# EAGLE design WaterThePlants (EAGLE 7.2.0)
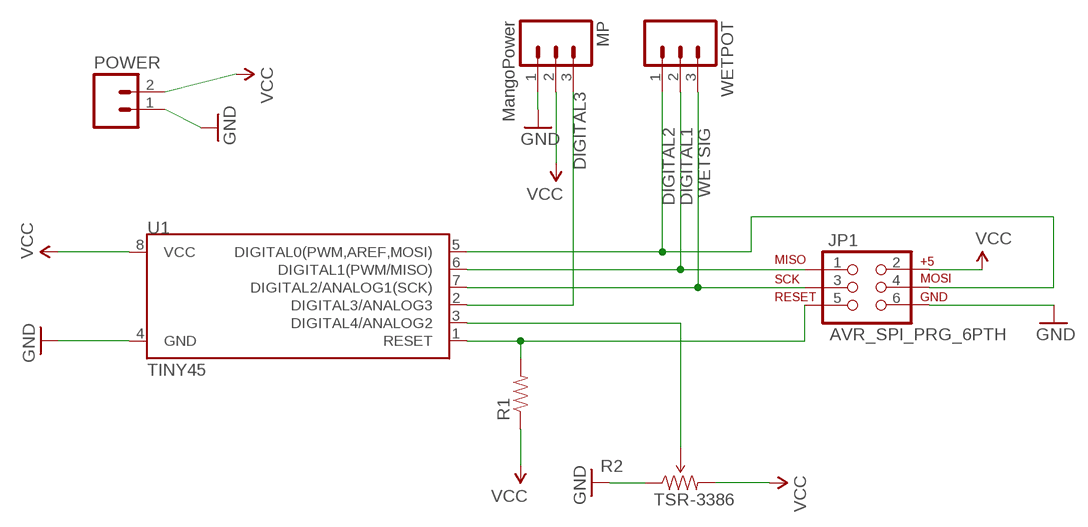
[diagram p0: schematic, sheet 1]

## Parts
JP1  AVR_SPI_PRG_6PTH  [2X3]
MP  MangoPower  M03PTH  [1X03]
POWER  M02POLAR  [MOLEX-1X2]
R1  RESISTORAXIAL-0.3  [AXIAL-0.3]
R2  TSR-3386  TRIMPOT3362U-2  [3362U-2]
U1  TINY45  ARDUINO-ATTINY45/85TINY45-20-DIP  [DIP08]
WETPOT  M03PTH  [1X03]

## Nets
DIGITAL1: JP1.1 U1.6(DIGITAL1(PWM/MISO)) WETPOT.2
DIGITAL2: JP1.4 U1.5(DIGITAL0(PWM,AREF,MOSI)) WETPOT.1
DIGITAL3: MP.3 U1.2(DIGITAL3/ANALOG3)
GND: JP1.6 MP.1 POWER.1 R2.1(CCW) U1.4(GND)
N$1: R2.2(WIPER) U1.3(DIGITAL4/ANALOG2)
N$6: JP1.5 R1.P$2 U1.1(RESET)
VCC: JP1.2 MP.2 POWER.2 R1.P$1 R2.3(CW) U1.8(VCC)
WETSIG: JP1.3 U1.7(DIGITAL2/ANALOG1(SCK)) WETPOT.3

## Library data of the parts
JP1 = SparkFun-Connectors:AVR_SPI_PRG_6: AVR ISP 6 Pin This is the reduced ISP connector for AVR programming. Common on Arduino. This footprint will take up less PCB space and can be used with a 10-pin to 6-pin adapter such as SKU: BOB-08508 **Special note about "TEST_POINT" package. The stop mask is on the top side, so if you want your programming test points to be on the bottom of your board, make sure to place this package on the bottom side of the board. This also ensure that the orientation to program from the bottom side will be correct.
MP WETPOT = SparkFun-Connectors:M03: Header 3 Standard 3-pin 0.1" header. Use with straight break away headers (SKU : PRT-00116), right angle break away headers (PRT-00553), swiss pins (PRT-00743), machine pins (PRT-00117), and female headers (PRT-00115). Molex polarized connector foot print use with SKU : PRT-08232 with associated crimp pins and housings.
POWER = SparkFun-Connectors:M02: Standard 2-pin 0.1" header. Use with - straight break away headers ( PRT-00116) - right angle break away headers (PRT-00553) - swiss pins (PRT-00743) - machine pins (PRT-00117) - female headers (PRT-00115) Molex polarized connector foot print use with: PRT-08233 with associated crimp pins and housings. 2.54_SCREWTERM for use with PRT-10571. 3.5mm Screw Terminal footprints for PRT-08084 5mm Screw Terminal footprints for use with PRT-08432
R1 = SparkFun-Resistors:RESISTOR: Resistor Basic schematic elements and footprints for 0603, 1206, and PTH resistors.
R2 = SparkFun-Electromechanical:TRIMPOT: Various small potentiometers for "set-and-forget" applications
U1 = Parnell-CustomParts:ARDUINO-ATTINY45/85: ARDUINO ATTINY45/85 Atmel 8-pin 2/4/8kB flash uC; PROD_ID: IC-09439; VALUE: TINY45-20-DIP

## Board
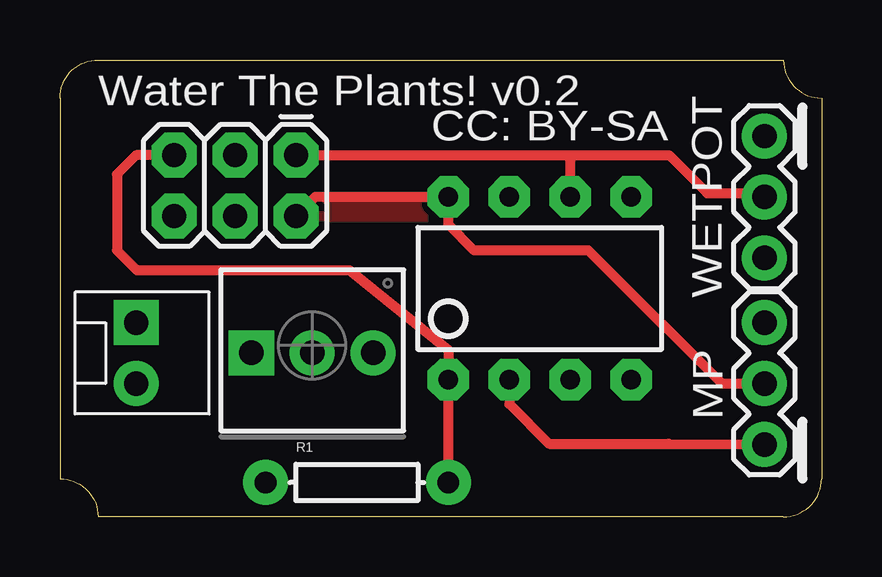
[diagram p1: board, top side]
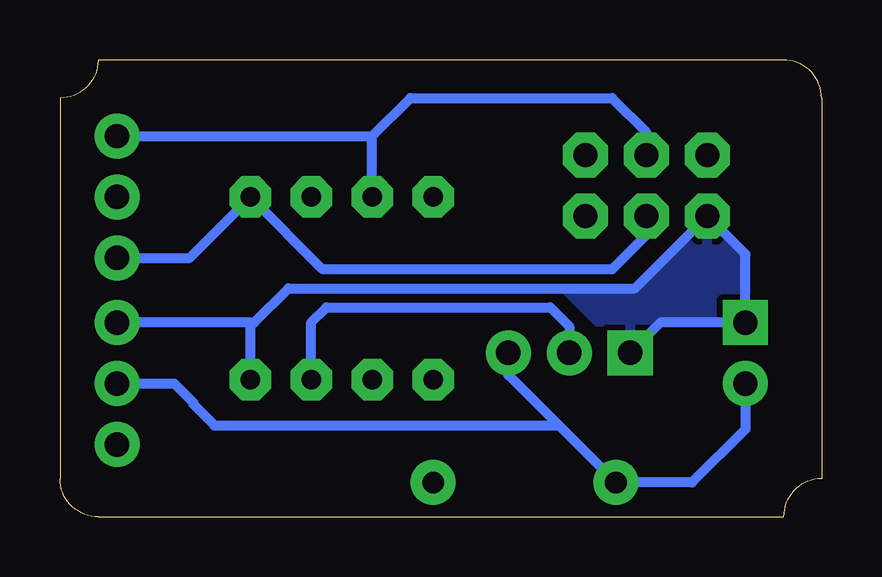
[diagram p2: board, bottom side, seen from below]

Size 31.75 x 19.05 mm. Coordinates in mm from the lower left corner, seen from the top.
Outline: 0,17.46 0,1.59 arc-90 1.59,0 30.16,0 arc90 31.75,1.59 31.75,17.46 arc-90 30.16,19.05 1.59,19.05 arc90 0,17.46
Copper layers (1*16): Top 0.0356mm / dielectric 1.5011mm / Bottom 0.0356mm
Design rules "LaenPCBOrder": minimum track width 6mil, minimum drill 13mil, track to track 6mil, track to pad 6mil, pad to pad 6mil, via to via 6mil, smd to smd 6mil, copper to edge 15mil, drill to drill 6mil, minimum pad ring 7mil, minimum via ring 7mil, stop-mask expansion 3mil, vias tented up to drill 0mil, thermal gap 10mil

### Footprints (pad centres in the part's own frame; a part is rotated, then mirrored left to right if it is on the bottom)
2X3 = drill 1.016 pad 1.88 octagon: 1 0,0; 2 0,2.54; 3 2.54,0; 4 2.54,2.54; 5 5.08,0; 6 5.08,2.54
1X03 = drill 1.016 pad 1.88: 1 0,0; 2 2.54,0; 3 5.08,0
MOLEX-1X2 = drill 1.016 pad 1.88 square: 1 0,0 | drill 1.016 pad 1.88: 2 2.54,0
AXIAL-0.3 = drill 0.9 pad 1.88: P$1 -3.81,0; P$2 3.81,0
3362U-2 = drill 1.016 pad 1.88 square: 1 -2.54,-0.305 | drill 1.016 pad 1.88: 2 0,-0.305; 3 2.54,-0.305
DIP08 = drill 0.813 pad 1.727 octagon: 1 -3.81,-3.81; 2 -1.27,-3.81; 3 1.27,-3.81; 4 3.81,-3.81; 5 3.81,3.81; 6 1.27,3.81; 7 -1.27,3.81; 8 -3.81,3.81

### Placement (x,y rotation side)
JP1  9.84,15.08 180 top
MP  29.37,8.1 270 top
POWER  3.17,8.1 270 top
R1  12.38,1.43 0 top
R2  10.52,7.14 0 top
U1  20,9.53 0 top
WETPOT  29.37,10.79 90 top

### Tracks (layer width: path | path; a pad name or v marks a point on that pad's centre or on a via)
DIGITAL1
  Top 0.406: JP1.1 21.43,15.08 | U1.6 21.27,14.92 21.43,15.08 | 21.43,15.08 25.4,15.08 26.99,13.49 29.21,13.49 WETPOT.2
DIGITAL2
  Bottom 0.406: JP1.4 7.3,11.75 8.73,10.32 20.8,10.32 U1.5 26.35,10.79 WETPOT.1
DIGITAL3
  Top 0.406: U1.2 18.73,4.7 20.38,3.05 25.37,3.05 MP.3
GND
  Bottom 0.406: 23.81,8.1 MP.1 | U1.4 23.81,8.1 | 23.81,8.1 23.65,8.1 22.23,9.53 7.78,9.53 JP1.6 3.17,10.95 POWER.1 6.72,8.1 R2.1
  pour Bottom: 7.94,6.95 8.14,6.95 10.72,9.53 7.74,9.53 4.76,12.5 3.17,10.91 3.17,8.14 6.75,8.14
N$1
  Bottom 0.406: U1.3 21.27,8.1 20.64,8.73 11.31,8.73 10.52,7.94 R2.2
N$6
  Top 0.406: JP1.5 3.17,15.08 2.38,14.29 2.38,11.11 3.21,10.29 12.06,10.29 16.19,6.95 U1.1 R1.P$2
VCC
  Top 0.406: MP.2 27.59,5.56 25.15,8 25.14,8 22.03,11.11 17.26,11.11 16.19,12.18 U1.8 10.64,13.34 JP1.2
  Bottom 0.406: POWER.2 3.17,3.65 5.4,1.43 R1.P$1 10.95,3.81 | MP.2 26.99,5.56 26.19,4.76 26.19,4.7 25.3,3.81 10.95,3.81 | R2.3 13.06,5.91 10.95,3.81
  pour Top: 9.72,12.5 16.27,12.5 16.27,13.3 10.52,13.3
WETSIG
  Bottom 0.406: U1.7 18.73,15.88 | 18.73,15.88 17.14,17.46 8.73,17.46 7.3,16.03 JP1.3 | WETPOT.3 18.73,15.88

### Text on the board
_tsilk: Water The Plants! v0.2 | CC: BY-SA
_bsilk: andrewparnell.com